# Altium schematic sheet Onboard_IO.SchDoc
size Tabloid; SheetNumber: 3; SheetTotal: 5; Sheet_Name: Onboard IO; Size: 11x17
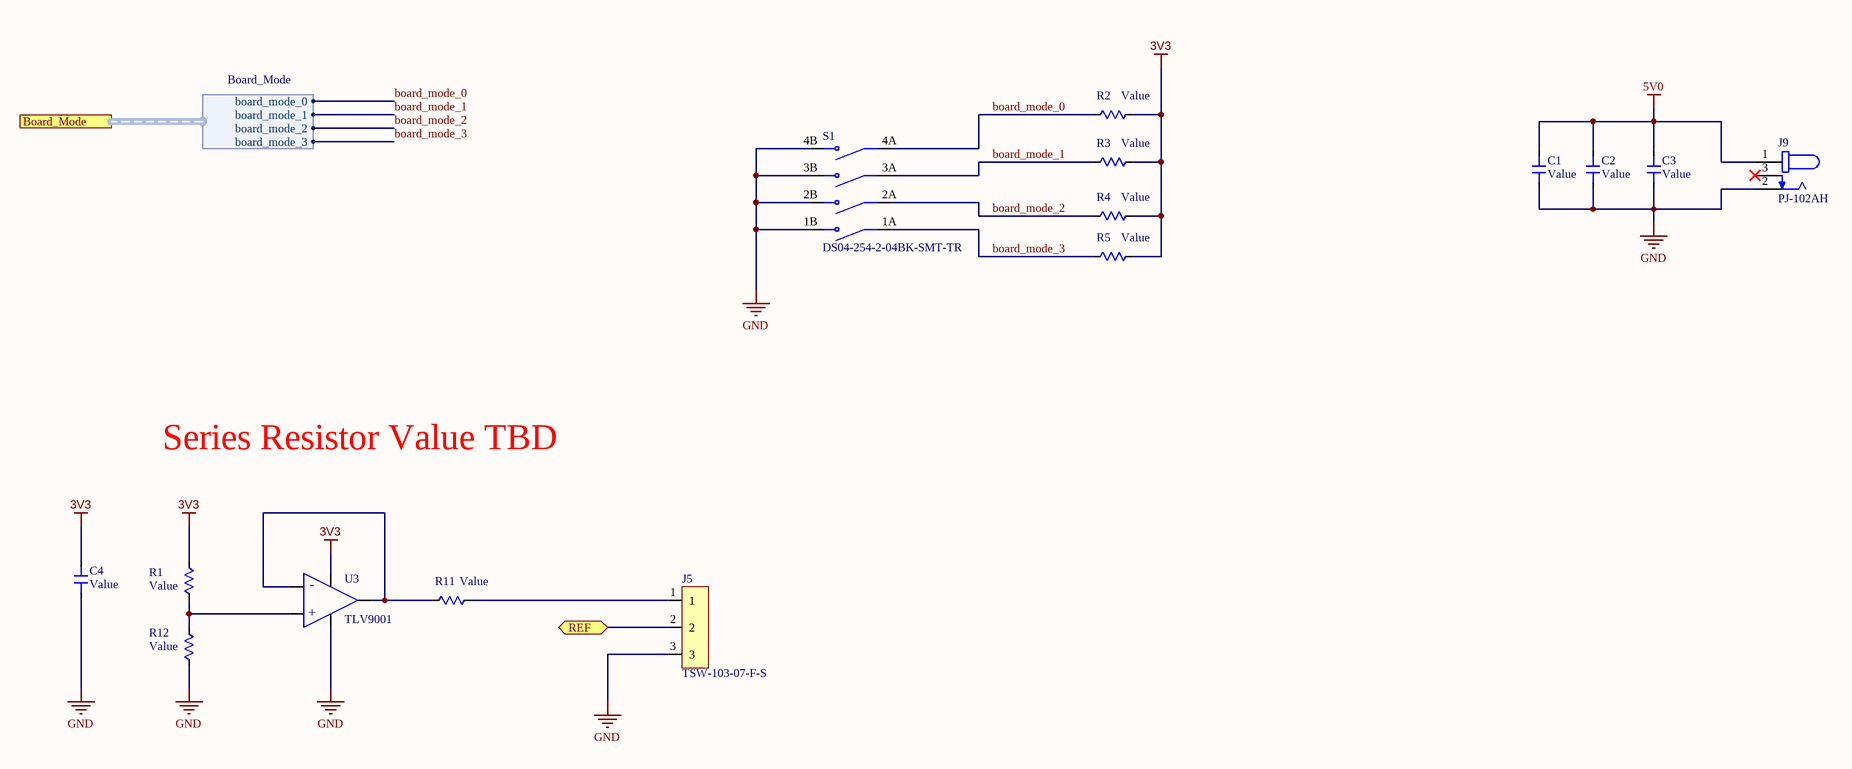
[diagram p0: Onboard_IO.SchDoc]

## Parts
C1  Value  [0805_CAPACITOR]
C2  Value  [0603_CAPACITOR]
C3  Value  [0603_CAPACITOR]
C4  Value  [0603_CAPACITOR]
J5  TSW-103-07-F-S  [SMTC-TSW-103-07-X-S]
J9  PJ-102AH  [CUI_PJ-102AH]
R1  Value  [0603_RESISTOR]
R2  Value  [0603_RESISTOR]
R3  Value  [0603_RESISTOR]
R4  Value  [0603_RESISTOR]
R5  Value  [0603_RESISTOR]
R11  Value  [0603_RESISTOR]
R12  Value  [0603_RESISTOR]
S1  DS04-254-2-04BK-SMT-TR  [SW_DS04-254-2-04BK-SMT-TR]
U3  TLV9001  [SOT-353]

## Ports
Board_Mode (harness Board_Mode), REF (bidir)

## Harnesses
Board_Mode: board_mode_0, board_mode_1, board_mode_2, board_mode_3

## Nets
3V3: C4.2 R1.1 R2.2 R3.2 R4.2 R5.2 U3.5(V+)
5V0: C1.2 C2.2 C3.2 J9.1
GND: C1.1 C2.1 C3.1 C4.1 J5.3 J9.2 R12.2 S1.1B(NO1) S1.2B(NO2) S1.3B(NO3) S1.4B(NO4) U3.2(V-)
board_mode_0: R2.1 S1.4A(COM4) ; port Board_Mode.board_mode_0
board_mode_1: R3.1 S1.3A(COM3) ; port Board_Mode.board_mode_1
board_mode_2: R4.1 S1.2A(COM2) ; port Board_Mode.board_mode_2
board_mode_3: R5.1 S1.1A(COM1) ; port Board_Mode.board_mode_3
REF: J5.2 ; port REF
NetJ5_1: J5.1 R11.2
NetR1_2: R1.2 R12.1 U3.3(IN+)
NetR11_1: R11.1 U3.1(Out) U3.4(IN-)

Not connected (* = marked no-connect by the designer): J9 3*

## Notes on the sheet
- Series Resistor Value TBD
- Sheet Name
- Project Title
- Global Project
- Size
- Group
- Revision
- Date
- Sheet
- of
- Filename
- Designers
- (in symbol IC_OP_AMP_1CH) -; +

## Library data of the parts
C1-C4 = Capacitor
J5 = CON_HEADER_1X3: 0.025" SQ Post Header, Through-hole, Vertical, -55 to 125 degC, 2.54 mm Pitch, 3-Pin, Male, RoHS
J9 = CON_PWR_24V_5A: Power Barrel Connector Jack 2.00mm ID (0.079"), 5.50mm OD (0.217") Through Hole, Right Angle; MF: Same Sky; SnapEDA_Link: https://www.snapeda.com/parts/PJ-102AH/Same+Sky/view-part/?ref=snap; Package: None; Value: *; MP: PJ-102AH; Check_prices: https://www.snapeda.com/parts/PJ-102AH/Same+Sky/view-part/?ref=eda
R1-R5 R11 R12 = Resistor: GRAMS Lib Spec: 2.7
S1 = SW_DIP_4_SMT: Dip Switch SPST 4 Position Surface Mount Slide (Standard) Actuator 25mA 24VDC; MF: Same Sky; SnapEDA_Link: https://www.snapeda.com/parts/DS04-254-2-04BK-SMT-TR/Same+Sky/view-part/?ref=snap; Package: None; Value: *; MP: DS04-254-2-04BK-SMT-TR; Check_prices: https://www.snapeda.com/parts/DS04-254-2-04BK-SMT-TR/Same+Sky/view-part/?ref=eda
U3 = IC_OP_AMP_1CH: CMOS Amplifier 1 Circuit Rail-to-Rail SC-70-5 / 1.8V - 5.5V